# EAGLE design Drone (EAGLE 9.6.2)
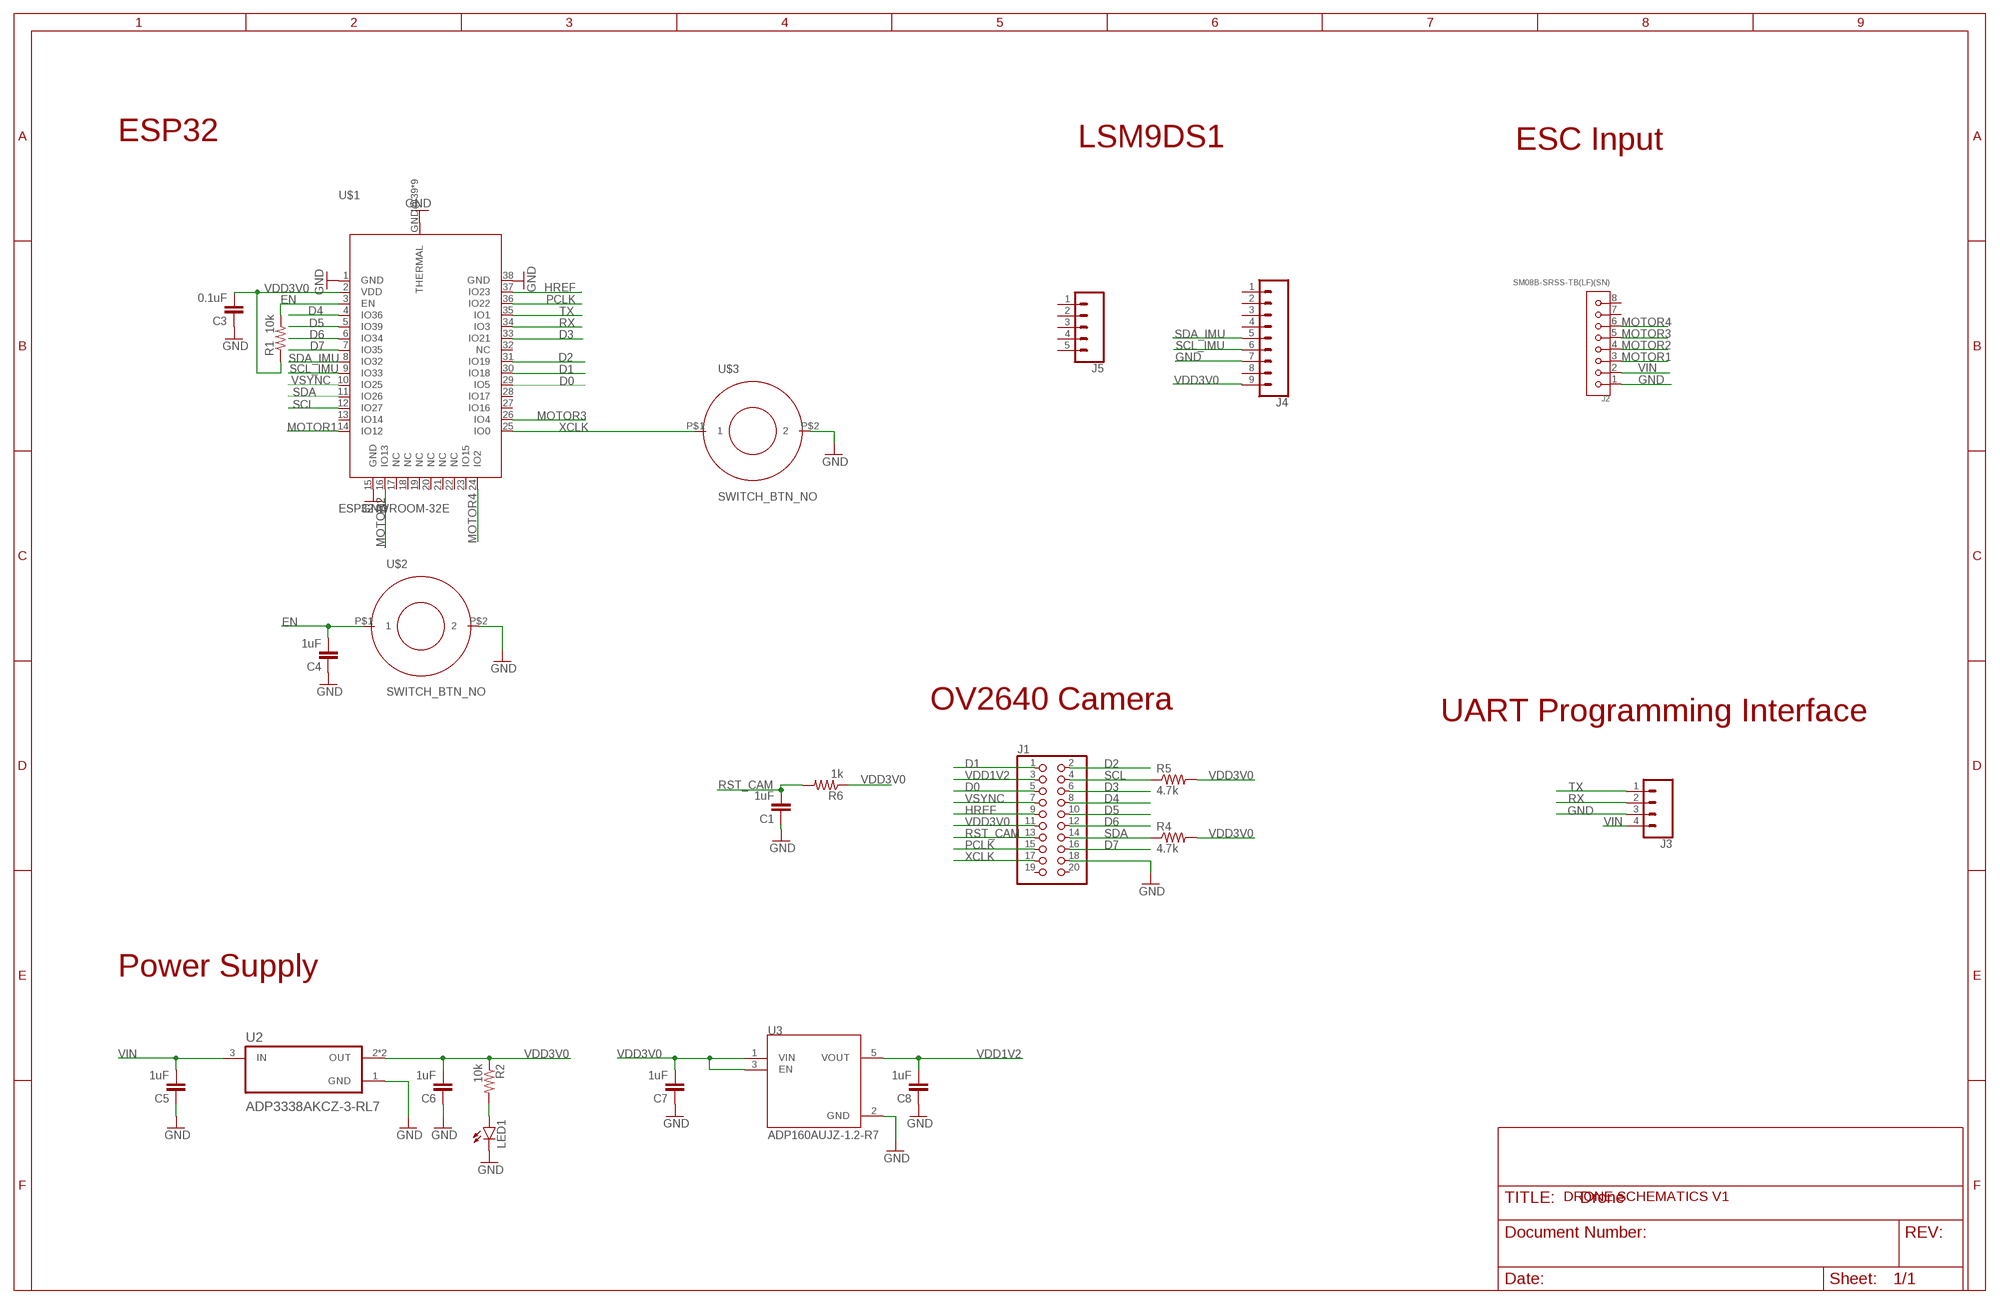
[diagram p0: schematic, sheet 1]

## Parts
C1  1uF  CAP  [0805]
C3  0.1uF  CAP  [0805]
C4  1uF  CAP  [0805]
C5  1uF  CAP  [0805]
C6  1uF  CAP  [0805]
C7  1uF  CAP  [0805]
C8  1uF  CAP  [0805]
J1  PINHD-2X10  [2X10]
J2  SM08B-SRSS-TB(LF)(SN)  [JST_SM08B-SRSS-TB(LF)(SN)]
J3  CONN_04PTH  [1X04]
J4  CONN_09NO_SILK  [1X09_NO_SILK]
J5  CONN_05NO_SILK  [1X05_NO_SILK]
LED1  LED0603  [LED-0603]
R1  10k  RES  [0805]
R2  10k  RES  [0805]
R4  4.7k  RES  [0805]
R5  4.7k  RES  [0805]
R6  1k  RES  [0805]
U2  ADP3338AKCZ-3-RL7  [SOT230P700X180-4N]
U3  ADP160AUJZ-1.2-R7  [SOT95P280X100-5N]
U$1  ESP32-WROOM-32E  [ESP32-WROOM-32E]
U$2  SWITCH_BTN_NO  [BTN_2]
U$3  SWITCH_BTN_NO  [BTN_2]

## Nets
D0: J1.5 U$1.29(IO5)
D1: J1.1 U$1.30(IO18)
D2: J1.2 U$1.31(IO19)
D3: J1.6 U$1.33(IO21)
D4: J1.8 U$1.4(IO36)
D5: J1.10 U$1.5(IO39)
D6: J1.12 U$1.6(IO34)
D7: J1.16 U$1.7(IO35)
EN: C4.2 R1.2 U$1.3(EN) U$2.P$1
GND: C1.1 C3.1 C4.1 C5.1 C6.1 C7.1 C8.1 J1.18 J2.1 J3.3 J4.7 LED1.C U2.1(GND) U3.2(GND) U$1.1(GND) U$1.15(GND) U$1.38(GND) U$1.GND@39(THERMAL) U$1.GND@40(THERMAL) U$1.GND@41(THERMAL) U$1.GND@42(THERMAL) U$1.GND@43(THERMAL) U$1.GND@44(THERMAL) U$1.GND@45(THERMAL) U$1.GND@46(THERMAL) U$1.GND@47(THERMAL) U$2.P$2 U$3.P$2
HREF: J1.9 U$1.37(IO23)
MOTOR1: J2.3 U$1.14(IO12)
MOTOR2: J2.4 U$1.16(IO13)
MOTOR3: J2.5 U$1.26(IO4)
MOTOR4: J2.6 U$1.24(IO2)
N$5: LED1.A R2.2
PCLK: J1.15 U$1.36(IO22)
RST_CAM: C1.2 J1.13 R6.2
RX: J3.2 U$1.34(IO3)
SCL: J1.4 R5.1 U$1.12(IO27)
SCL_IMU: J4.6 U$1.9(IO33)
SDA: J1.14 R4.1 U$1.11(IO26)
SDA_IMU: J4.5 U$1.8(IO32)
TX: J3.1 U$1.35(IO1)
VDD1V2: C8.2 J1.3 U3.5(VOUT)
VDD3V0: C3.2 C6.2 C7.2 J1.11 J4.9 R1.1 R2.1 R4.2 R5.2 R6.1 U2.2(OUT) U2.4(OUT) U3.1(VIN) U3.3(EN) U$1.2(VDD)
VIN: C5.2 J2.2 J3.4 U2.3(IN)
VSYNC: J1.7 U$1.10(IO25)
XCLK: J1.17 U$1.25(IO0) U$3.P$1
Unconnected: J1.19 J1.20 J2.7 J2.8 J4.1 J4.2 J4.3 J4.4 J4.8 J5.1 J5.2 J5.3 J5.4 J5.5 U$1.13(IO14) U$1.17(NC) U$1.18(NC) U$1.19(NC) U$1.20(NC) U$1.21(NC) U$1.22(NC) U$1.23(IO15) U$1.27(IO16) U$1.28(IO17) U$1.32(NC)

## Notes on the sheet
- ESP32 | LSM9DS1 | ESC Input
- OV2640 Camera
- UART Programming Interface
- Power Supply
- DRONE SCHEMATICS V1

## Library data of the parts
C1 C3-C8 = Ilya_Teach:CAP
J1 = SparkFun-Retired:PINHD-2X10: PIN HEADER
J2 = SM08B-SRSS-TB_LF__SN_:SM08B-SRSS-TB(LF)(SN): Check availability <https://pricing.snapeda.com/parts/SM08B-SRSS-TB%20%28LF%29%28SN%29/JST%20Sales/view-part?ref=eda>; AVAILABILITY: In Stock; CHECK_PRICES: https://www.snapeda.com/parts/SM08B-SRSS-TB%20(LF)(SN)/JST/view-part/?ref=eda; DESCRIPTION: Connector Header Surface Mount, Right Angle 8 position 0.039 (1.00mm); MF: JST Sales; MP: SM08B-SRSS-TB (LF)(SN); PACKAGE: None; PRICE: None; SNAPEDA_LINK: https://www.snapeda.com/parts/SM08B-SRSS-TB%20(LF)(SN)/JST/view-part/?ref=snap
J3 = SparkFun-Connectors:CONN_04: Multi connection point. Often used as Generic Header-pin footprint for 0.1 inch spaced/style header connections On any of the 0.1 inch spaced packages, you can populate with these: Break Away Headers - Straight <https://www.sparkfun.com/products/116> (PRT-00116) Break Away Male Headers - Right Angle <https://www.sparkfun.com/products/553> (PRT-00553) Female Headers <https://www.sparkfun.com/products/115> (PRT-00115) Break Away Headers - Machine Pin <https://www.sparkfun.com/products/117> (PRT-00117) Break Away Female Headers - Swiss Machine Pin <https://www.sparkfun.com/products/743> (PRT-00743) For SCREWTERMINALS and SPRING TERMINALS visit here: Screw Terimnals on SparkFun.com <https://www.sparkfun.com/search/results?term=Screw+Terminals> (5mm/3.5mm/2.54mm spacing) This device is also useful as a general connection point to wire up your design to another part of your project. Our various solder wires solder well into these plated through hole pads. Hook-Up Wire - Assortment (Stranded, 22 AWG) <https://www.sparkfun.com/products/11375> (PRT-11375) Hook-Up Wire - Assortment (Solid Core, 22 AWG) <https://www.sparkfun.com/products/11367> (PRT-11367) View the entire wire category on our website here <https://www.sparkfun.com/categories/141> Special notes: Molex polarized connector foot print use with SKU : PRT-08231 with associated crimp pins and housings. 1MM SMD Version SKU: PRT-10208; PROD_ID: CONN-09696
J4 = SparkFun-Connectors:CONN_09: Multi connection point. Often used as Generic Header-pin footprint for 0.1 inch spaced/style header connections On any of the 0.1 inch spaced packages, you can populate with these: Break Away Headers - Straight <https://www.sparkfun.com/products/116> (PRT-00116) Break Away Male Headers - Right Angle <https://www.sparkfun.com/products/553> (PRT-00553) Female Headers <https://www.sparkfun.com/products/115> (PRT-00115) Break Away Headers - Machine Pin <https://www.sparkfun.com/products/117> (PRT-00117) Break Away Female Headers - Swiss Machine Pin <https://www.sparkfun.com/products/743> (PRT-00743) For SCREWTERMINALS and SPRING TERMINALS visit here: Screw Terimnals on SparkFun.com <https://www.sparkfun.com/search/results?term=Screw+Terminals> (5mm/3.5mm/2.54mm spacing) This device is also useful as a general connection point to wire up your design to another part of your project. Our various solder wires solder well into these plated through hole pads. Hook-Up Wire - Assortment (Stranded, 22 AWG) <https://www.sparkfun.com/products/11375> (PRT-11375) Hook-Up Wire - Assortment (Solid Core, 22 AWG) <https://www.sparkfun.com/products/11367> (PRT-11367) View the entire wire category on our website here <https://www.sparkfun.com/categories/141> Special notes: Molex polarized connector foot print use with SKU : PRT-08231 with associated crimp pins and housings. 1MM SMD Version SKU: PRT-10208 NOTES ON THE VARIANTS LOCK and LOCK_LONGPADS... This footprint was designed to help hold the alignment of a through-hole component (i.e. 6-pin header) while soldering it into place. You may notice that each hole has been shifted either up or down by 0.005 of an inch from it's more standard position (which is a perfectly straight line). This slight alteration caused the pins (the squares in the middle) to touch the edges of the holes. Because they are alternating, it causes a "brace" to hold the component in place. 0.005 has proven to be the perfect amount of "off-center" position when using our standard breakaway headers. Although looks a little odd when you look at the bare footprint, once you have a header in there, the alteration is very hard to notice. Also,if you push a header all the way into place, it is covered up entirely on the bottom side.
J5 = SparkFun-Connectors:CONN_05: Multi connection point. Often used as Generic Header-pin footprint for 0.1 inch spaced/style header connections On any of the 0.1 inch spaced packages, you can populate with these: Break Away Headers - Straight <https://www.sparkfun.com/products/116> (PRT-00116) Break Away Male Headers - Right Angle <https://www.sparkfun.com/products/553> (PRT-00553) Female Headers <https://www.sparkfun.com/products/115> (PRT-00115) Break Away Headers - Machine Pin <https://www.sparkfun.com/products/117> (PRT-00117) Break Away Female Headers - Swiss Machine Pin <https://www.sparkfun.com/products/743> (PRT-00743) For SCREWTERMINALS and SPRING TERMINALS visit here: Screw Terimnals on SparkFun.com <https://www.sparkfun.com/search/results?term=Screw+Terminals> (5mm/3.5mm/2.54mm spacing) This device is also useful as a general connection point to wire up your design to another part of your project. Our various solder wires solder well into these plated through hole pads. Hook-Up Wire - Assortment (Stranded, 22 AWG) <https://www.sparkfun.com/products/11375> (PRT-11375) Hook-Up Wire - Assortment (Solid Core, 22 AWG) <https://www.sparkfun.com/products/11367> (PRT-11367) View the entire wire category on our website here <https://www.sparkfun.com/categories/141> Special notes: Molex polarized connector foot print use with SKU : PRT-08231 with associated crimp pins and housings. 1MM SMD Version SKU: PRT-10208
LED1 = Ilya_Teach:LED: LEDs Standard schematic elements and footprints for 5mm, 3mm, 1206, and 0603 sized LEDs. 5mm - Spark Fun Electronics SKU : COM-00529 (and others)
R1 R2 R4-R6 = Ilya_Teach:RES
U2 = ADP3338AKCZ-3-RL7:ADP3338AKCZ-3-RL7; CHECK_PRICES: https://www.snapeda.com/parts/ADP3338AKCZ-3-RL7/Analog+Devices/view-part/?ref=eda; DESCRIPTION: High Accuracy Ultralow Quiescent Current, 1A, anyCAP® Dropout Regulator; DIGIKEY_PART_NUMBER: 505-ADP3338AKCZ-3-RL7TR-ND; MF: Analog Devices; MP: ADP3338AKCZ-3-RL7; PACKAGE: SOT-223-3 Analog Devices; SNAPEDA_LINK: https://www.snapeda.com/parts/ADP3338AKCZ-3-RL7/Analog+Devices/view-part/?ref=snap
U3 = ADP160AUJZ-1.2-R7:ADP160AUJZ-1.2-R7: Check availability <https://pricing.snapeda.com/parts/ADP160AUJZ-1.2-R7/Analog%20Devices/view-part?ref=eda>; AVAILABILITY: In Stock; CHECK_PRICES: https://www.snapeda.com/parts/ADP160AUJZ-1.2-R7/Analog+Devices/view-part/?ref=eda; DESCRIPTION: Ultra Low Quiescent Current 150 mA, CMOS Linear Regulator; MF: Analog Devices; MP: ADP160AUJZ-1.2-R7; PACKAGE: TSOT-5 Analog Devices; PRICE: None; SNAPEDA_LINK: https://www.snapeda.com/parts/ADP160AUJZ-1.2-R7/Analog+Devices/view-part/?ref=snap
U$1 = Ilya_Teach:ESP32-WROOM-32E
U$2 U$3 = Ilya_Teach:SWITCH_BTN_NO

## Board
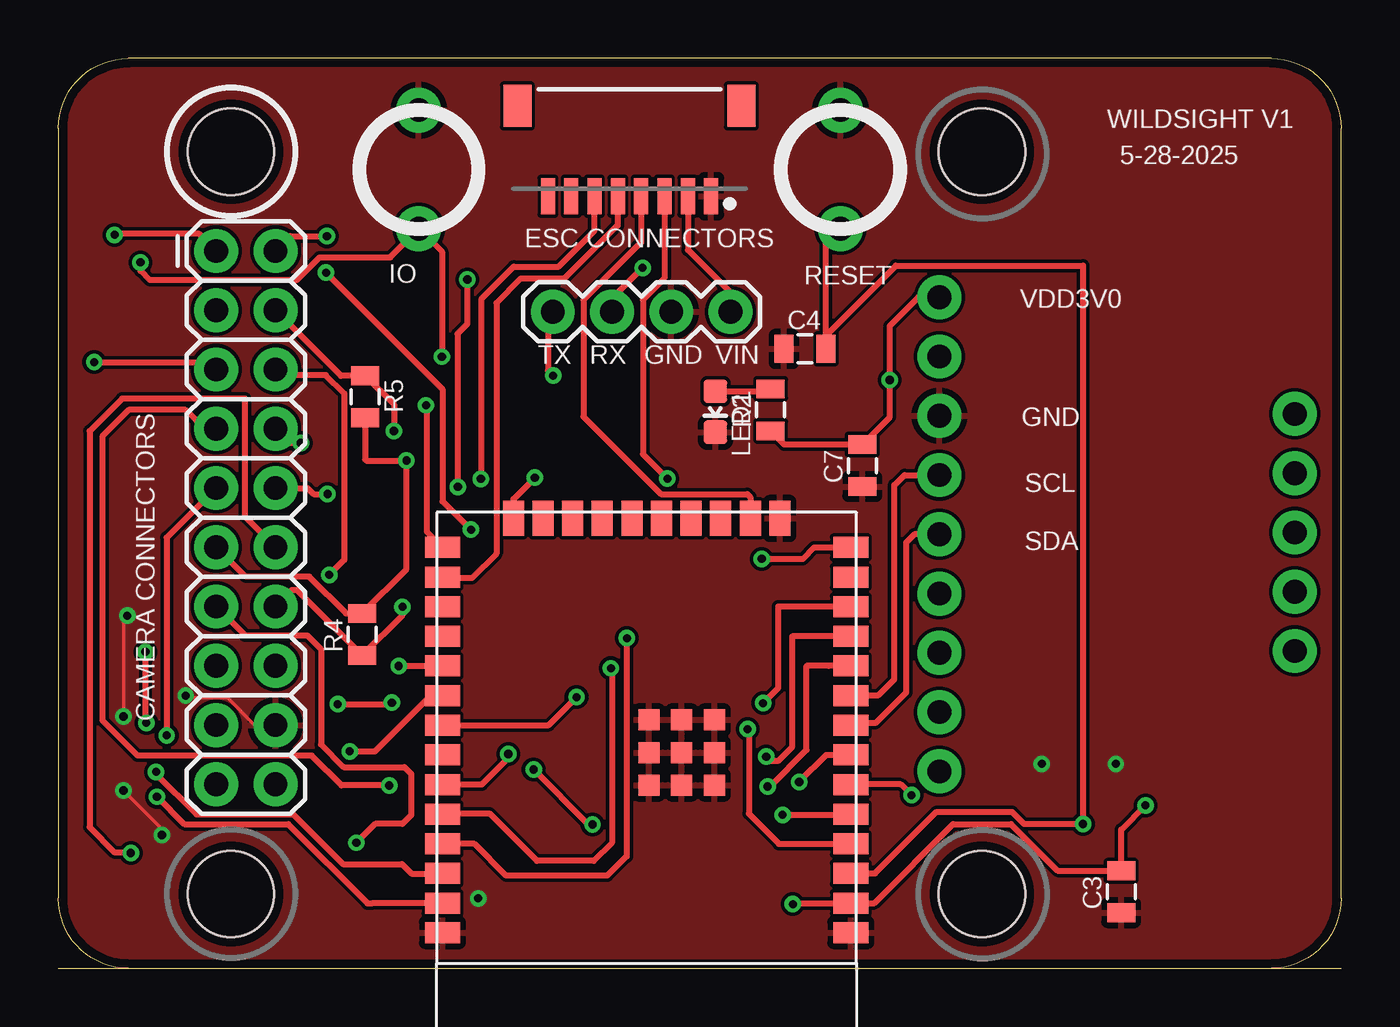
[diagram p1: board, top side]
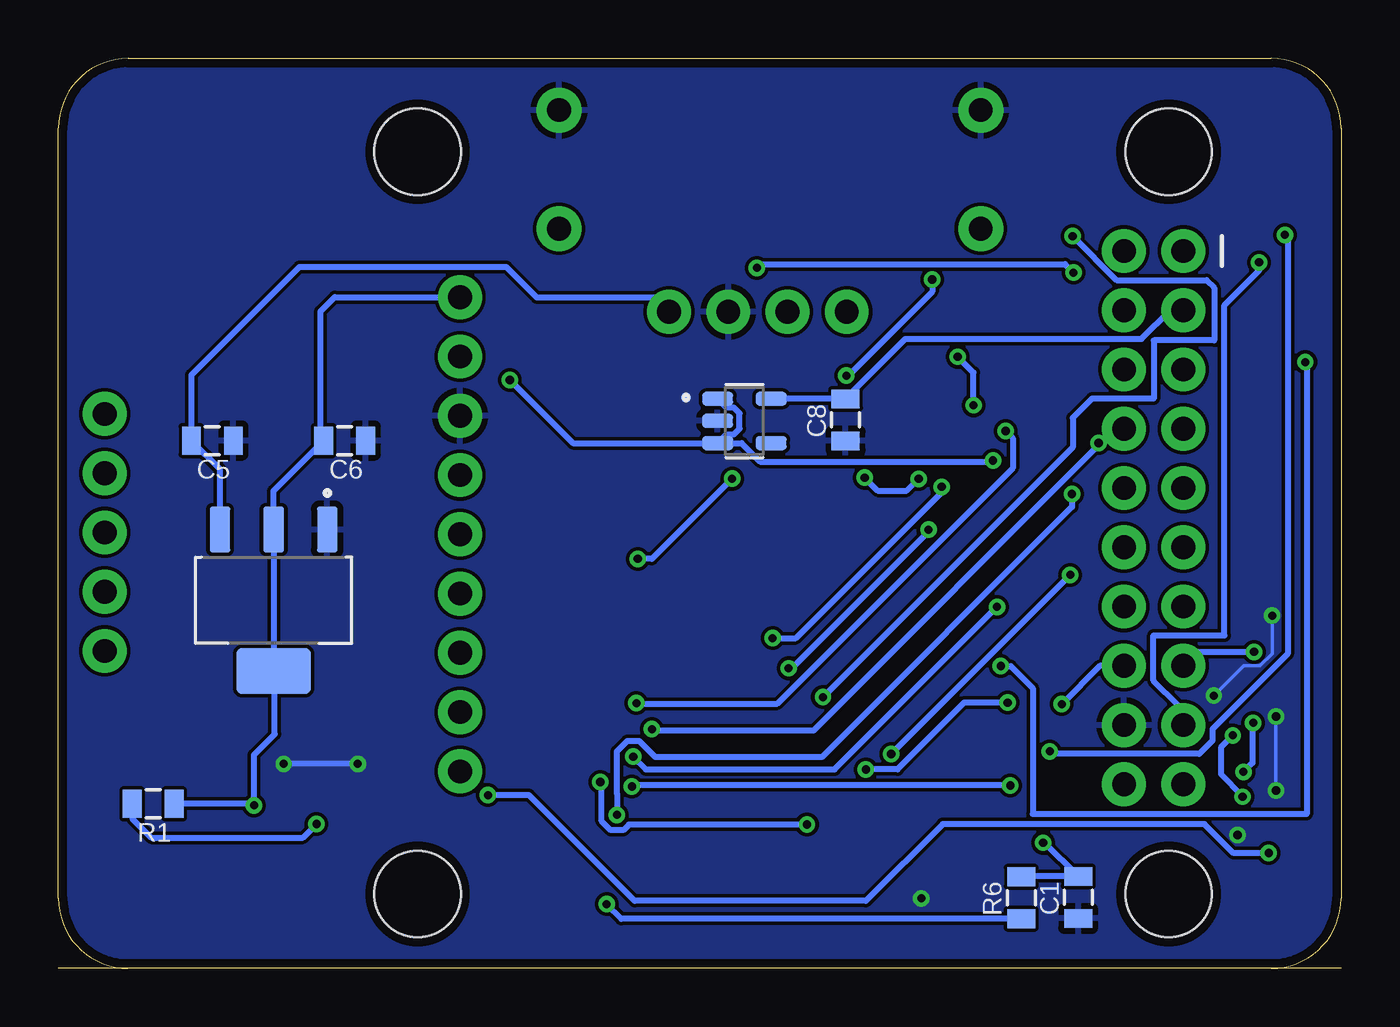
[diagram p2: board, bottom side, seen from below]

Size 55 x 39 mm. Coordinates in mm from the lower left corner, seen from the top.
Outline: 0,0 3,0
Outline: 3,0 52,0
Outline: 52,0 55,0
Outline: 3,0 arc-90 0,3 0,36 arc-90 3,39 52,39 arc-90 55,36 55,3 arc-90 52,0
Copper layers (1*16): Top 0.0356mm / dielectric 1.5011mm / Bottom 0.0356mm
Design rules "LaenPCBOrder (2) *": minimum track width 6mil, minimum drill 13mil, track to track 6mil, track to pad 6mil, pad to pad 6mil, via to via 6mil, smd to smd 6mil, copper to edge 15mil, drill to drill 6mil, minimum pad ring 7mil, minimum via ring 7mil, stop-mask expansion 3mil, vias tented up to drill 0.4mm, thermal gap 10mil
Holes 3.7 mm at 7.4,3.19 39.6,3.19 7.4,35 39.6,35

### Footprints (pad centres in the part's own frame; a part is rotated, then mirrored left to right if it is on the bottom)
0805 = smd 0.8 x 1.2: 1 -0.9,0; 2 0.9,0
2X10 = drill 1.016 pad 1.88: 1 0,0; 2 0,2.54; 3 2.54,0; 4 2.54,2.54; 5 5.08,0; 6 5.08,2.54; 7 7.62,0; 8 7.62,2.54; 9 10.16,0; 10 10.16,2.54; 11 12.7,0; 12 12.7,2.54; 13 15.24,0; 14 15.24,2.54; 15 17.78,0; 16 17.78,2.54; 17 20.32,0; 18 20.32,2.54; 19 22.86,0; 20 22.86,2.54
JST_SM08B-SRSS-TB(LF)(SN) = smd 0.6 x 1.55: 1 -3.5,4.775; 2 -2.5,4.775; 3 -1.5,4.775; 4 -0.5,4.775; 5 0.5,4.775; 6 1.5,4.775; 7 2.5,4.775; 8 3.5,4.775 | smd 1.2 x 1.8: P1 -4.8,0.9; P2 4.8,0.9
1X04 = drill 1.016 pad 1.88: 1 0,0; 2 2.54,0; 3 5.08,0; 4 7.62,0
1X09_NO_SILK = drill 1.016 pad 1.88: 1 0,0; 2 2.54,0; 3 5.08,0; 4 7.62,0; 5 10.16,0; 6 12.7,0; 7 15.24,0; 8 17.78,0; 9 20.32,0
1X05_NO_SILK = drill 1.016 pad 1.88: 1 0,0; 2 2.54,0; 3 5.08,0; 4 7.62,0; 5 10.16,0
LED-0603 = smd 1 x 1: A 0,-0.877; C 0,0.877
SOT230P700X180-4N = smd 1.97 x 0.89: 1 -3.025,2.3; 2 -3.025,0; 3 -3.025,-2.3 | smd 1.97 x 3.19: 4 3.025,0
SOT95P280X100-5N = smd 1.32 x 0.59: 1 -1.145,0.95; 2 -1.145,0; 3 -1.145,-0.95; 4 1.145,-0.95; 5 1.145,0.95
ESP32-WROOM-32E = smd 1.5 x 0.9: 1 -8.75,8.255; 2 -8.75,6.985; 3 -8.75,5.715; 4 -8.75,4.445; 5 -8.75,3.175; 6 -8.75,1.905; 7 -8.75,0.635; 8 -8.75,-0.635; 9 -8.75,-1.905; 10 -8.75,-3.175; 11 -8.75,-4.445; 12 -8.75,-5.715; 13 -8.75,-6.985; 14 -8.75,-8.255; 25 8.75,-8.255; 26 8.75,-6.985; 27 8.75,-5.715; 28 8.75,-4.445; 29 8.75,-3.175; 30 8.75,-1.905; 31 8.75,-0.635; 32 8.75,0.635; 33 8.75,1.905; 34 8.75,3.175; 35 8.75,4.445; 36 8.75,5.715; 37 8.75,6.985; 38 8.75,8.255 | smd 0.9 x 1.5: 15 -5.715,-9.505; 16 -4.445,-9.505; 17 -3.175,-9.505; 18 -1.905,-9.505; 19 -0.635,-9.505; 20 0.635,-9.505; 21 1.905,-9.505; 22 3.175,-9.505; 23 4.445,-9.505; 24 5.715,-9.505 | smd 0.9 x 0.9: GND@39 -2.9,1.935; GND@40 -1.5,1.935; GND@41 -0.1,1.935; GND@42 -2.9,0.535; GND@43 -1.5,0.535; GND@44 -0.1,0.535; GND@45 -2.9,-0.865; GND@46 -1.5,-0.865; GND@47 -0.1,-0.865
BTN_2 = drill 1.016 pad 1.93: P$1 -2.54,0; P$2 2.54,0

### Placement (x,y rotation side)
C1  11.27,3.04 90 bottom
C3  45.57,3.28 90 top
C4  32.01,26.54 0 top
C5  48.4,22.61 180 bottom
C6  42.72,22.61 180 bottom
C7  34.47,21.55 90 top
C8  21.25,23.51 90 bottom
J1  6.77,30.75 270 top
J2  24.49,37.87 180 top
J3  21.2,28.14 0 top
J4  37.77,8.44 90 top
J5  53.01,13.6 90 top
LED1  28.17,23.86 180 top
R1  50.93,7.05 180 bottom
R2  30.54,23.93 90 top
R4  13.03,14.31 90 top
R5  13.16,24.49 270 top
R6  13.72,3.02 90 bottom
U2  45.77,15.78 270 bottom
U3  25.59,23.46 0 bottom
U$1  25.22,9.78 180 top
U$2  33.54,34.24 90 top
U$3  15.46,34.24 90 top

### Tracks (layer width: path | path; a pad name or v marks a point on that pad's centre or on a via)
D0  (via drill 0.35)
  Top 0.254: J1.5 6.48,25.95 1.51,25.95 v1.54,25.98 | v14.59,12.95 v14.6,12.96 U$1.29
  Bottom 0.254: v1.54,25.98 1.54,25.75 1.48,25.7 1.48,6.61 13.23,6.61 13.23,12.01 14.17,12.95 v14.59,12.95
D1  (via drill 0.35)
  Top 0.254: J1.1 6.04,31.48 2.46,31.48 v2.42,31.43 | v12.49,9.3 13.58,9.3 15.96,11.69 U$1.30
  Bottom 0.254: v2.42,31.43 2.3,31.32 2.3,13.48 5.52,10.26 5.52,9.76 6.09,9.19 12.38,9.19 v12.49,9.3
D2  (via drill 0.35)
  Top 0.152: v22.22,11.61 v22.22,11.62
  Top 0.254: J1.2 9.94,31.38 v11.51,31.38 | v22.22,11.61 21.02,10.42 U$1.31
  Bottom 0.254: v22.22,11.62 11.51,22.33 11.51,23.59 10.69,24.42 8.04,24.42 8.04,26.92 5.44,26.92 5.44,29.16 5.78,29.49 9.63,29.49 v11.51,31.38
D3  (via drill 0.35)
  Top 0.254: J1.6 9.56,25.42 11.47,25.42 12.26,24.64 12.26,17.51 v11.61,16.86 | U$1.33 18.15,7.88 19.3,9.03 v19.3,9.19
  Bottom 0.254: v19.3,9.19 v19.29,9.19 v11.61,16.86
D4  (via drill 0.35)
  Top 0.254: v10.4,22.51 9.92,22.51 J1.8 | v29.55,10.25 29.6,10.2 29.6,6.63 30.89,5.34 U$1.4
  Bottom 0.254: v10.4,22.51 10.4,22.41 22.61,10.2 29.5,10.2 v29.55,10.25
D5  (via drill 0.35)
  Top 0.254: J1.10 10.69,20.59 10.95,20.32 v11.54,20.32 | v31.05,6.58 33.94,6.58 U$1.5
  Bottom 0.254: v31.05,6.58 31.05,7.5 31.06,7.52 31.06,9.29 30.61,9.74 30.09,9.74 29.4,9.05 22.27,9.05 11.54,19.77 v11.54,20.32
D6  (via drill 0.35)
  Top 0.254: v3.11,4.94 3.09,4.96 2.43,4.96 1.34,6.05 1.34,23.02 2.74,24.42 8,24.42 8,19.86 | J1.12 8,19.36 8,19.86 | v36.58,7.42 36.12,7.88 U$1.6 | 8,19.86
  Bottom 0.254: v3.11,4.94 4.62,4.94 5.86,6.18 17.09,6.18 20.38,2.89 30.29,2.89 34.83,7.42 v36.58,7.42
D7  (via drill 0.35)
  Top 0.254: v11.98,11.32 14.24,11.32 v14.3,11.38 | v20.38,8.52 22.74,6.16 v22.9,6.16 | v31.76,7.99 32.92,9.15 U$1.7
  Bottom 0.254: J1.16 10.34,12.96 v11.98,11.32 | v20.38,8.52 v20.37,8.53 19.02,8.53 16.17,11.38 v14.3,11.38 | v22.9,6.16 30.53,6.16 30.78,5.92 31.32,5.92 31.71,6.3 31.71,7.93 v31.76,7.99
EN  (via drill 0.35)
  Top 0.254: U$2.P$1 32.91,31.07 C4.2 32.91,27.12 35.91,30.12 43.93,30.12 v43.93,6.18 43.92,6.2 41.4,6.2 40.89,6.7 37.65,6.7 35.02,4.07 U$1.3
  Bottom 0.254: R1.2 51.83,6.42 51.02,5.6 44.51,5.6 v43.93,6.18
GND  (via drill 0.35)
  Top 0.152: J1.18 8.42,10.43 7.26,11.59 5.55,11.59 v5.46,11.68 | v2.96,15.11 2.79,14.95 v2.79,10.79 | v2.79,7.62 4.45,5.97 v4.45,5.71
  Bottom 0.152: v5.46,11.68 4.19,12.96 3.48,12.96 2.96,13.48 v2.96,15.11 | v2.79,10.79 v2.79,7.62
  Bottom 0.254: v42.16,8.76 v45.34,8.76
  other vias: 18,3
  pour Top: -4.43,0 -4.43,39.49 56.64,39.49 56.64,0
  pour Bottom: -4.43,0 -4.43,39.52 56.56,39.52 56.56,0
HREF  (via drill 0.35)
  Top 0.254: J1.9 4.65,18.46 v4.65,9.98 | v4.23,7.35 5.4,6.18 9.86,6.18 13.25,2.78 13.45,2.78 | U$1.37 16.46,2.78 13.45,2.78 | 13.45,2.78
  Bottom 0.254: v4.23,7.35 4.23,7.41 5.15,8.33 5.15,9.47 v4.65,9.98
MOTOR1  (via drill 0.35)
  Top 0.254: J2.3 25.99,29.58 25.06,28.65 25.06,22.04 v26.11,20.98 | v30.16,17.55 31.92,17.55 32.41,18.04 U$1.14
  Bottom 0.254: v26.11,20.98 29.55,17.55 v30.16,17.55
MOTOR2
  Top 0.254: J2.4 24.99,31.12 22.52,28.65 22.52,23.65 25.84,20.32 29.54,20.32 29.67,20.2 U$1.16
MOTOR3
  Top 0.254: J2.5 23.98,31.84 21.69,29.56 19.83,29.56 18.78,28.51 18.78,17.78 17.72,16.72 16.52,16.72 U$1.26
MOTOR4  (via drill 0.35)
  Top 0.254: v20.43,21.03 19.51,20.11 U$1.24 | v18.12,20.98 18.13,20.99 18.13,28.68 19.53,30.07 21.45,30.07 22.99,31.61 J2.6
  Bottom 0.254: v18.12,20.98 18.62,20.48 19.88,20.48 v20.43,21.03
N$5
  Top 0.254: LED1.A 30.44,24.73 R2.2
PCLK  (via drill 0.35)
  Top 0.254: v3.73,13.57 3.73,10.56 v3.77,10.52 | v4.19,8.42 4.19,8.33 5.92,6.6 10.08,6.6 12.21,4.47 14.73,4.47 15.14,4.06 U$1.36
  Bottom 0.254: J1.15 6.17,13.57 v3.73,13.57 | v3.77,10.52 3.81,10.48 3.81,8.8 v4.19,8.42
RST_CAM  (via drill 0.35)
  Top 0.254: J1.13 8,14.27 10.67,14.27 11.27,13.68 11.27,9.6 12.24,8.62 14.84,8.62 15.12,8.34 15.12,6.57 14.75,6.2 13.59,6.2 v12.78,5.38
  Bottom 0.254: R6.2 13.71,3.94 C1.2 12.71,5.38 v12.78,5.38
RX  (via drill 0.35)
  Top 0.254: J3.2 23.74,28.71 v25.05,30.02 | v11.48,29.82 16.47,24.82 16.47,20.02 v17.7,18.79 v17.7,18.8 | v23.69,12.86 23.73,12.82 23.73,5.38 22.96,4.6 20.52,4.6 18.48,6.64 16.51,6.64 U$1.34
  Bottom 0.254: v25.05,30.02 24.9,30.18 11.84,30.18 v11.48,29.82 | v23.69,12.86 23.54,12.86 17.7,18.71 v17.7,18.8
SCL  (via drill 0.35)
  Top 0.254: J1.4 12.12,25.39 R5.1 14.39,24.17 v14.39,23.03 | v30.21,11.36 30.86,12.01 30.86,15.51 U$1.12
  Bottom 0.254: v14.39,23.03 14.08,22.72 14.08,21.44 24.18,11.34 30.19,11.34 v30.21,11.36
SCL_IMU
  Top 0.254: U$1.9 33.99,11.71 35.16,11.71 35.84,12.38 35.84,20.71 36.28,21.14 J4.6
SDA  (via drill 0.35)
  Top 0.254: J1.14 10.01,16.21 10.23,16.21 R4.1 14.76,15.14 v14.76,15.49 | v30.35,9.07 30.35,8.88 30.85,8.88 31.47,9.5 31.47,14.23 U$1.11
  Bottom 0.254: v14.76,15.49 21.72,8.53 29.81,8.53 v30.35,9.07
SDA_IMU
  Top 0.254: J4.5 36.7,18.6 36.34,18.24 36.34,11.82 35.03,10.51 34.06,10.51 U$1.8
TX  (via drill 0.35)
  Top 0.254: J3.1 21,27.94 21,25.62 v21.21,25.4 | v17.53,29.52 17.53,27.61 17.12,27.19 v17.12,20.64 v17.13,20.64 | v24.38,14.15 24.37,14.14 24.37,4.8 23.54,3.97 19.21,3.97 17.84,5.34 U$1.35
  Bottom 0.254: v21.21,25.4 21.13,25.4 17.53,29 v17.53,29.52 | v24.38,14.15 23.38,14.15 17.13,20.4 v17.13,20.64
VDD1V2
  Bottom 0.254: U3.5 C8.2 18.69,26.97 8.57,26.97 7.34,28.2 J1.3
VDD3V0  (via drill 0.35)
  Top 0.254: R2.1 31.13,22.45 33.86,22.45 33.87,22.45 C7.2 35.64,23.62 v35.64,25.21 35.64,27.53 36.87,28.76 J4.9 | R5.2 13.16,21.86 13.2,21.76 v14.93,21.76 14.93,17.11 R4.2 12.33,15.21 10.76,16.78 8.03,16.78 J1.11 | v31.49,2.75 31.54,2.8 U$1.2 34.98,2.8 38.36,6.18 40.84,6.18 42.83,4.18 C3.2 45.57,5.94 v46.61,6.99
  Bottom 0.254: J4.9 43.15,28.76 43.75,28.16 43.75,22.74 C6.2 45.77,20.47 U2.2 U2.4 45.72,12.71 45.72,10.03 46.61,9.14 v46.61,6.99 46.67,7.05 R1.1 | U3.3 26.36,22.89 26.04,22.89 25.79,23.14 25.79,23.78 26.04,24.03 26.36,24.03 U3.1 | U3.3 32.94,22.51 v35.64,25.21 | U3.3 25.71,22.51 24.91,21.71 14.97,21.71 v14.93,21.76 | R6.1 30.86,2.12 v31.49,2.75
VIN
  Top 0.254: J2.2 26.99,30.79 28.81,28.96 J3.4
  Bottom 0.254: U2.3 48.07,21.38 C5.2 49.3,25.42 44.67,30.05 35.79,30.05 34.49,28.75 29.43,28.75 J3.4
VSYNC  (via drill 0.35)
  Top 0.254: v30.41,7.79 30.5,7.79 32.08,9.37 32.08,12.96 33.03,12.96 U$1.10 | v14.19,7.84 12.15,7.84 10.86,9.12 3.4,9.12 1.89,10.62 1.89,22.8 3.02,23.93 5.45,23.93 6.26,23.12 J1.7
  Bottom 0.254: v30.41,7.79 30.33,7.87 14.22,7.87 v14.19,7.84
XCLK  (via drill 0.35)
  Top 0.254: v16.44,26.21 16.44,30.71 U$3.P$1 14.23,30.47 11.2,30.47 10.22,29.49 3.93,29.49 3.52,29.9 v3.52,30.25 | v15.76,24.13 15.8,24.1 15.8,18.72 U$1.25
  Bottom 0.254: v3.52,30.25 3.52,29.9 5,28.43 5,14.27 8.05,14.27 8.05,12.34 6.98,11.27 6.98,10.64 J1.17 | v15.76,24.13 15.76,25.53 v16.44,26.21

### Text on the board
tPlace: WILDSIGHT V1 | 5-28-2025 | ESC CONNECTORS | IO | RESET | VDD3V0 | TX | RX | GND | VIN | CAMERA CONNECTORS | GND | SCL | SDA